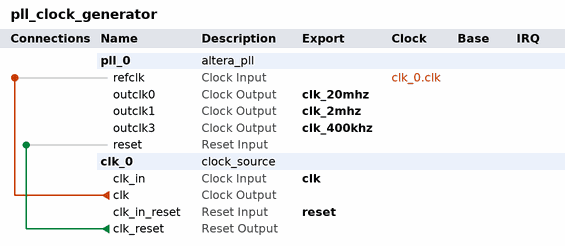
[diagram p0: system contents]
# Platform Designer (Qsys) system pll_clock_generator, Arria V 5AGXFB3H4F35C4
# Parameters at their usual value, and those the tool derives, are not listed.
package require -exact qsys 19.1
create_system pll_clock_generator
set_project_property DEVICE_FAMILY {Arria V}
set_project_property DEVICE 5AGXFB3H4F35C4

add_instance pll_0 altera_pll 19.1
set_instance_parameter_value pll_0 gui_channel_spacing 1.0
set_instance_parameter_value pll_0 gui_device_speed_grade 1
set_instance_parameter_value pll_0 gui_en_adv_params true
set_instance_parameter_value pll_0 gui_number_of_clocks 4
set_instance_parameter_value pll_0 gui_operation_mode normal
set_instance_parameter_value pll_0 gui_output_clock_frequency0 20.0
set_instance_parameter_value pll_0 gui_output_clock_frequency1 20.0
set_instance_parameter_value pll_0 gui_output_clock_frequency2 20.0
set_instance_parameter_value pll_0 gui_output_clock_frequency3 100.0
set_instance_parameter_value pll_0 gui_pll_auto_reset On
set_instance_parameter_value pll_0 gui_pll_mode {Integer-N PLL}
set_instance_parameter_value pll_0 gui_reference_clock_frequency 50.0
set_instance_parameter_value pll_0 gui_use_locked false

add_instance clk_0 clock_source 19.1
set_instance_parameter_value clk_0 clockFrequency 100000000
set_instance_parameter_value clk_0 resetSynchronousEdges BOTH

# connections
add_connection clk_0.clk pll_0.refclk clock
add_connection clk_0.clk_reset pll_0.reset reset

# exported interfaces
add_interface clk clock sink
set_interface_property clk EXPORT_OF clk_0.clk_in
add_interface clk_20mhz clock source
set_interface_property clk_20mhz EXPORT_OF pll_0.outclk0
add_interface clk_2mhz clock source
set_interface_property clk_2mhz EXPORT_OF pll_0.outclk1
add_interface clk_400khz clock source
set_interface_property clk_400khz EXPORT_OF pll_0.outclk3
add_interface reset reset sink
set_interface_property reset EXPORT_OF clk_0.clk_in_reset

set_interconnect_requirement {$system} qsys_mm.clockCrossingAdapter HANDSHAKE
set_interconnect_requirement {$system} qsys_mm.enableEccProtection FALSE
set_interconnect_requirement {$system} qsys_mm.insertDefaultSlave FALSE
set_interconnect_requirement {$system} qsys_mm.maxAdditionalLatency 1

save_system pll_clock_generator.qsys
